# Altium schematic sheet AD9361_TEST_COUPON_EBB.SchDoc
size A4; SheetNumber: 1; SheetTotal: 2
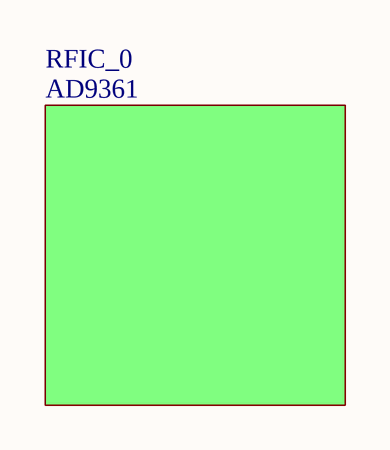
[diagram p0: AD9361_TEST_COUPON_EBB.SchDoc]

## Sub-sheets
RFIC_0 = AD9361: no entries